# EAGLE schematic NES (EAGLE 6.0)
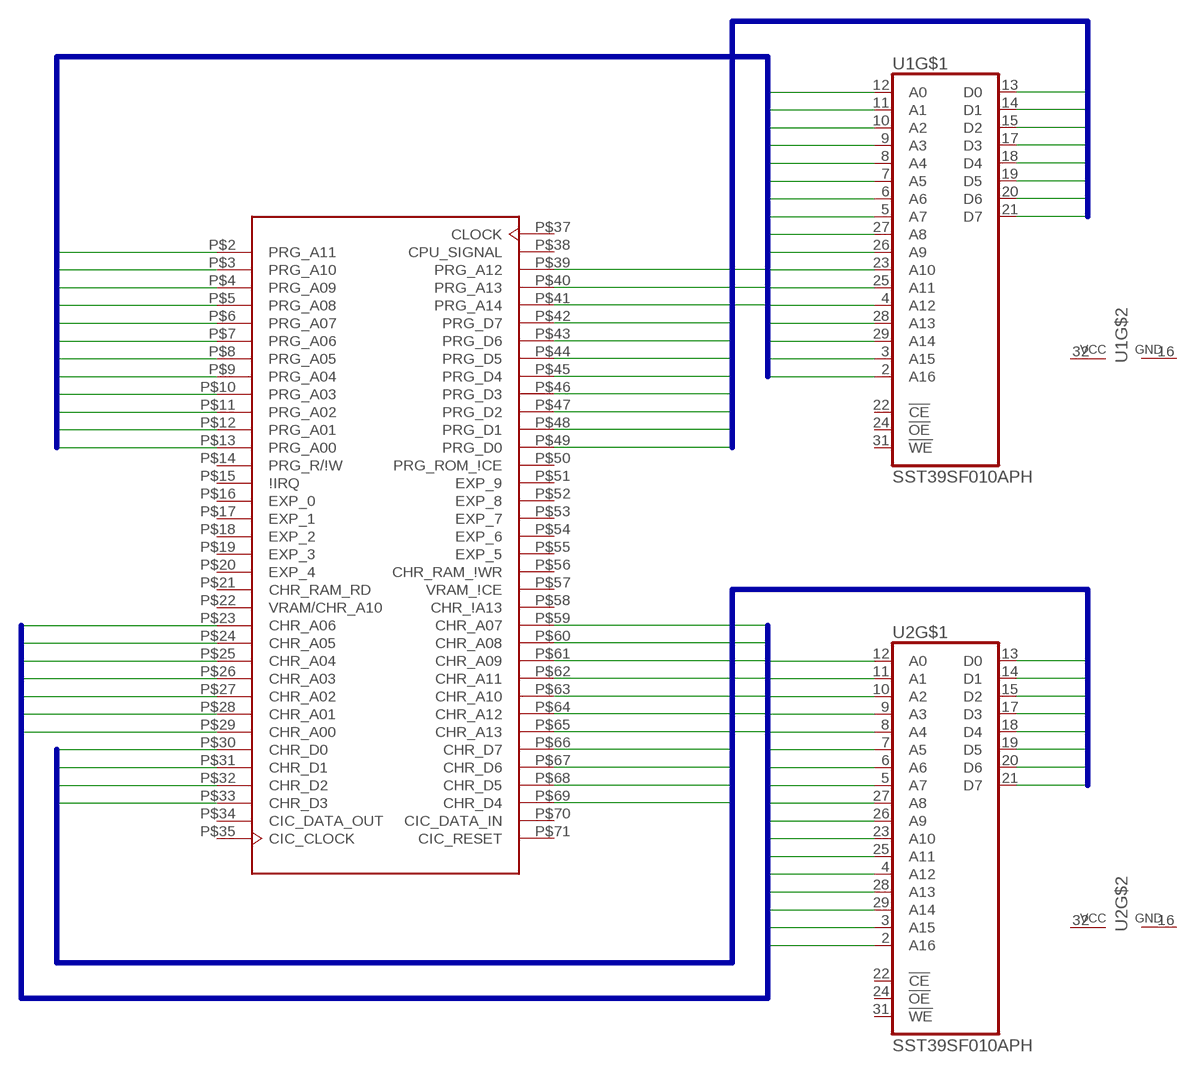
[diagram p0: schematic, sheet 1]

## Parts
U1  SST39SF010APH  [PDIP32]
U2  SST39SF010APH  [PDIP32]
U$1  NES-EDGE-PIN_ORDER  [NES-EDGE]

## Nets
CHR_ADDR_0: U2.12(A0) U$1.P$29(CHR_A00)
CHR_ADDR_1: U2.11(A1) U$1.P$28(CHR_A01)
CHR_ADDR_2: U2.10(A2) U$1.P$27(CHR_A02)
CHR_ADDR_3: U2.9(A3) U$1.P$26(CHR_A03)
CHR_ADDR_4: U2.8(A4) U$1.P$25(CHR_A04)
CHR_ADDR_5: U2.7(A5) U$1.P$24(CHR_A05)
CHR_ADDR_6: U2.6(A6) U$1.P$23(CHR_A06)
CHR_ADDR_7: U2.5(A7) U$1.P$59(CHR_A07)
CHR_ADDR_8: U2.27(A8) U$1.P$60(CHR_A08)
CHR_ADDR_9: U2.26(A9) U$1.P$61(CHR_A09)
CHR_ADDR_10: U2.23(A10) U$1.P$63(CHR_A10)
CHR_ADDR_11: U2.25(A11) U$1.P$62(CHR_A11)
CHR_ADDR_12: U2.4(A12) U$1.P$64(CHR_A12)
CHR_ADDR_13: U2.28(A13) U$1.P$65(CHR_A13)
CHR_ADDR_14: U2.29(A14)
CHR_ADDR_15: U2.3(A15)
CHR_ADDR_16: U2.2(A16)
CHR_DATA_0: U2.13(D0) U$1.P$30(CHR_D0)
CHR_DATA_1: U2.14(D1) U$1.P$31(CHR_D1)
CHR_DATA_2: U2.15(D2) U$1.P$32(CHR_D2)
CHR_DATA_3: U2.17(D3) U$1.P$33(CHR_D3)
CHR_DATA_4: U2.18(D4) U$1.P$69(CHR_D4)
CHR_DATA_5: U2.19(D5) U$1.P$68(CHR_D5)
CHR_DATA_6: U2.20(D6) U$1.P$67(CHR_D6)
CHR_DATA_7: U2.21(D7) U$1.P$66(CHR_D7)
PRG_ADDR_0: U1.12(A0) U$1.P$13(PRG_A00)
PRG_ADDR_1: U1.11(A1) U$1.P$12(PRG_A01)
PRG_ADDR_2: U1.10(A2) U$1.P$11(PRG_A02)
PRG_ADDR_3: U1.9(A3) U$1.P$10(PRG_A03)
PRG_ADDR_4: U1.8(A4) U$1.P$9(PRG_A04)
PRG_ADDR_5: U1.7(A5) U$1.P$8(PRG_A05)
PRG_ADDR_6: U1.6(A6) U$1.P$7(PRG_A06)
PRG_ADDR_7: U1.5(A7) U$1.P$6(PRG_A07)
PRG_ADDR_8: U1.27(A8) U$1.P$5(PRG_A08)
PRG_ADDR_9: U1.26(A9) U$1.P$4(PRG_A09)
PRG_ADDR_10: U1.23(A10) U$1.P$3(PRG_A10)
PRG_ADDR_11: U1.25(A11) U$1.P$2(PRG_A11)
PRG_ADDR_12: U1.4(A12) U$1.P$39(PRG_A12)
PRG_ADDR_13: U1.28(A13) U$1.P$40(PRG_A13)
PRG_ADDR_14: U1.29(A14) U$1.P$41(PRG_A14)
PRG_ADDR_15: U1.3(A15)
PRG_ADDR_16: U1.2(A16)
PRG_DATA_0: U1.13(D0) U$1.P$49(PRG_D0)
PRG_DATA_1: U1.14(D1) U$1.P$48(PRG_D1)
PRG_DATA_2: U1.15(D2) U$1.P$47(PRG_D2)
PRG_DATA_3: U1.17(D3) U$1.P$46(PRG_D3)
PRG_DATA_4: U1.18(D4) U$1.P$45(PRG_D4)
PRG_DATA_5: U1.19(D5) U$1.P$44(PRG_D5)
PRG_DATA_6: U1.20(D6) U$1.P$43(PRG_D6)
PRG_DATA_7: U1.21(D7) U$1.P$42(PRG_D7)
Unconnected: U1.22(!CE) U1.24(!OE) U1.31(!WE) U2.22(!CE) U2.24(!OE) U2.31(!WE) U$1.P$14(PRG_R/\!W) U$1.P$15(\!IRQ) U$1.P$16(EXP_0) U$1.P$17(EXP_1) U$1.P$18(EXP_2) U$1.P$19(EXP_3) U$1.P$20(EXP_4) U$1.P$21(CHR_RAM_RD) U$1.P$22(VRAM/CHR_A10) U$1.P$34(CIC_DATA_OUT) U$1.P$35(CIC_CLOCK) U$1.P$37(CLOCK) U$1.P$38(CPU_SIGNAL) U$1.P$50(PRG_ROM_\!CE) U$1.P$51(EXP_9) U$1.P$52(EXP_8) U$1.P$53(EXP_7) U$1.P$54(EXP_6) U$1.P$55(EXP_5) U$1.P$56(CHR_RAM_\!WR) U$1.P$57(VRAM_\!CE) U$1.P$58(CHR_\!A13) U$1.P$70(CIC_DATA_IN) U$1.P$71(CIC_RESET)

## Buses
CHR_DATA_[0..7]
CHR_ADDR_[0..16]
PRG_DATA_[0..7]
PRG_ADDR_[0..16]

## Power pins joined to a net without a drawn wire
GND: U1.16(GND) U2.16(GND) U$1.P$1(GND) U$1.P$72(GND)
VCC: U1.32(VCC) U2.32(VCC) U$1.P$36(VCC)

## Library data of the parts
U1 U2 = Custom:SST39SF010A
U$1 = nintendo_nes_cartedge:NES-EDGE-PIN_ORDER